# Altium project WaveRadio.PrjPCB
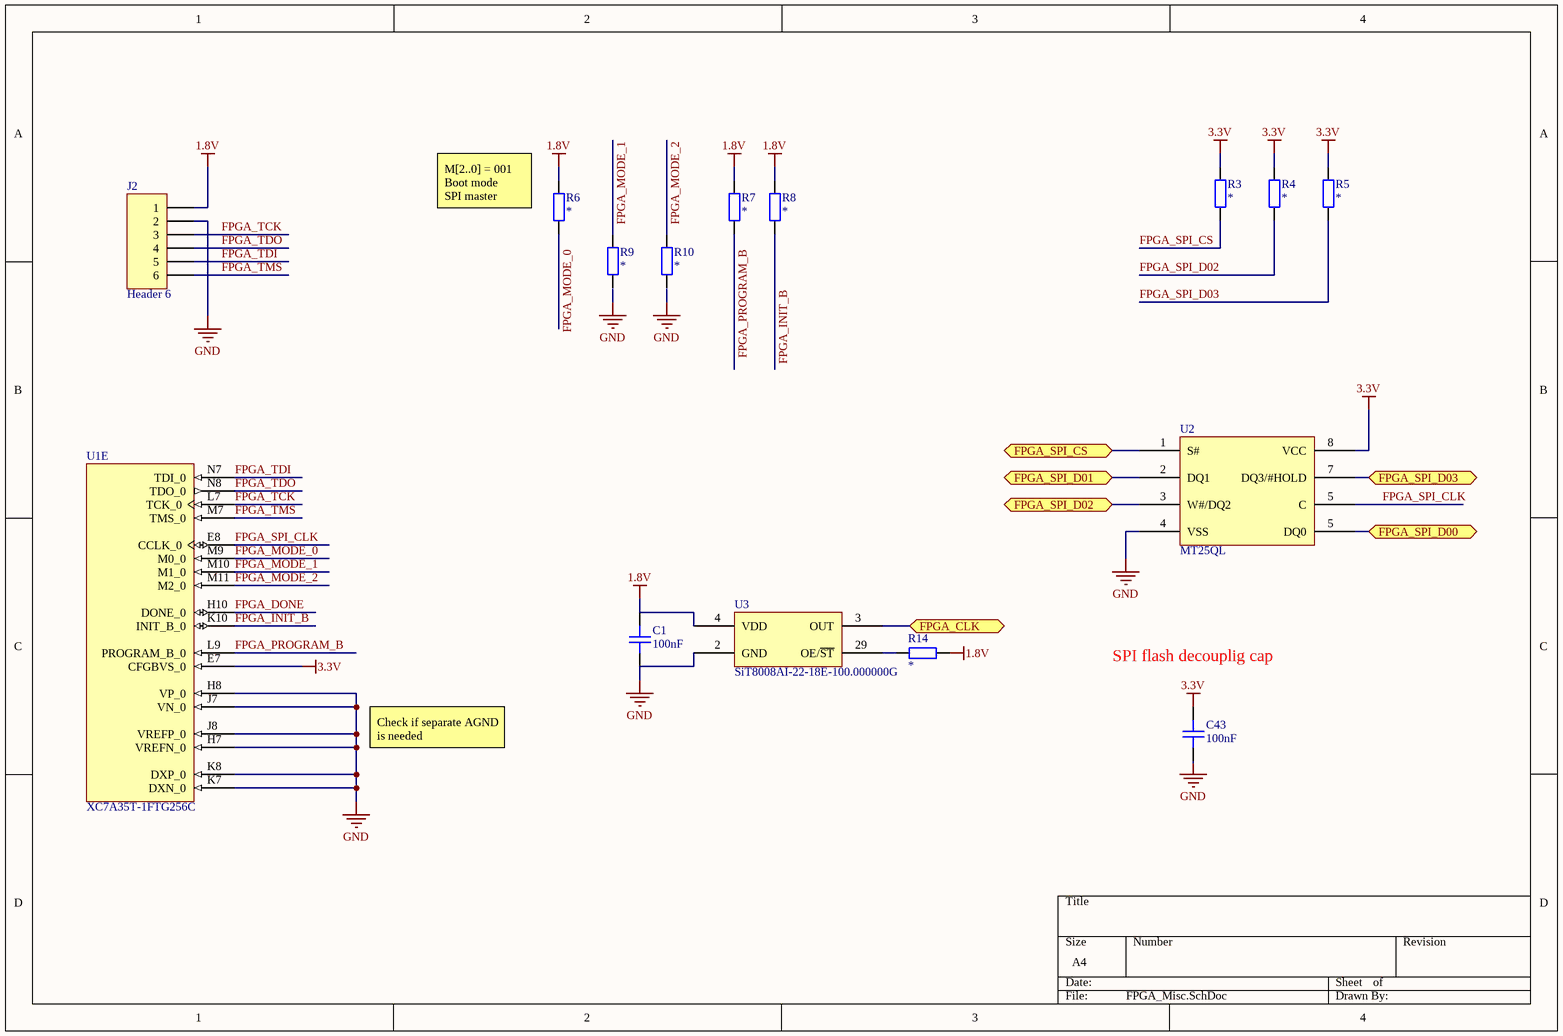
[diagram p0: FPGA_Misc.SchDoc]
4 sheets, 103 parts. Net scope: flat (ports and power ports of the same name join across sheets).
Board file: PCB1.PcbDoc
Sheets:
  FPGA_Misc.SchDoc
  USB3.0.SchDoc
  FPGA_Banks.SchDoc
  FPGA_Power.SchDoc

## Sheet FPGA_Misc.SchDoc
size A4

### Parts
C1  100nF  [CAP0402]
C43  100nF  [CAP0402]
J2  Header 6  [HDR1X6]
R3  *  [RES0402]
R4  *  [RES0402]
R5  *  [RES0402]
R6  *  [RES0402]
R7  *  [RES0402]
R8  *  [RES0402]
R9  *  [RES0402]
R10  *  [RES0402]
R14  *  [RES0402]
U1  XC7A35T-1FTG256C  [FTG256]  (part E of 8)
U2  MT25QL
U3  SiT8008AI-22-18E-100.000000G

### Ports
FPGA_CLK, FPGA_SPI_CS, FPGA_SPI_D00, FPGA_SPI_D01, FPGA_SPI_D02, FPGA_SPI_D03

### Nets
1.8V: J2.1 U3.4(VDD)
3.3V: U1.E7(CFGBVS_0) U2.8(VCC)
GND: J2.2 U1.H7(VREFN_0) U1.H8(VP_0) U1.J7(VN_0) U1.J8(VREFP_0) U1.K7(DXN_0) U1.K8(DXP_0) U2.4(VSS) U3.2(GND)
FPGA_DONE: U1.H10(DONE_0)
FPGA_INIT_B: U1.K10(INIT_B_0)
FPGA_MODE_0: U1.M9(M0_0)
FPGA_MODE_1: U1.M10(M1_0)
FPGA_MODE_2: U1.M11(M2_0)
FPGA_PROGRAM_B: U1.L9(PROGRAM_B_0)
FPGA_SPI_CLK: U1.E8(CCLK_0) U2.5(C)
FPGA_SPI_CS: U2.1(S#) ; port FPGA_SPI_CS
FPGA_SPI_D00: U2.5(DQ0) ; port FPGA_SPI_D00
FPGA_SPI_D01: U2.2(DQ1) ; port FPGA_SPI_D01
FPGA_SPI_D02: U2.3(W#/DQ2) ; port FPGA_SPI_D02
FPGA_SPI_D03: U2.7(DQ3/#HOLD) ; port FPGA_SPI_D03
FPGA_TCK: J2.3 U1.L7(TCK_0)
FPGA_TDI: J2.5 U1.N7(TDI_0)
FPGA_TDO: J2.4 U1.N8(TDO_0)
FPGA_TMS: J2.6 U1.M7(TMS_0)
NetU1_N14: U3.3(OUT) ; port FPGA_CLK

Not connected (* = marked no-connect by the designer): C1 1 2; C43 1 2; R3 1 2; R4 1 2; R5 1 2; R6 1 2; R7 1 2; R8 1 2; R9 1 2; R10 1 2; R14 1 2; U3 29(OE/~{ST})

### Notes on the sheet
- (near R6) M[2..0] = 001
  Boot mode
  SPI master
- (near C43) SPI flash decouplig cap
- Check if separate AGND is needed
- Labels drawn without touching a wire or pin: 1.8V, 3.3V

### Library data of the parts
C1 C43 = Cap_0402: Value: 100nF
J2 = Header 6: Header, 6-Pin; LatestRevisionDate: 17-Jul-2002; LatestRevisionNote: Re-released for DXP Platform.; Publisher: Altium Limited
R3-R10 R14 = Res_0402: Value: *
U1 = XC7A35T-1FTG256C: Artix-7 FPGA, 170 User I/Os, 0 GTP, 256-Ball BGA, Speed Grade 1, Commercial Grade, Pb-Free; Manufacturer: Xilinx; Total Block RAM: 1800 Kb; GTP: 0; Clock Mgmt Tiles (CMTs): 5; Logic Cells: 33280; Available User I/O: 170; Speed Grades: 1; DatasheetVersion: v1.15; PackageVersion: Rev. 1.11; PackageReference: FTG-256; PackageDescription: 256-Ball Wire-Bond Fine-Pitch Thin BGA, Body 17 x 17 mm, Pitch 1 mm; Maximum Distributed RAM: 400 Kb; Operating Temperature Range: Commercial; NexusDeviceID: XC7A35T-1FTG256C; Mounting Technology: Surface Mount; PartNumber: XC7A35T-1FTG256C; ComponentLink1Description: Manufacturer URL; ComponentLink1URL: http://www.xilinx.com/; ComponentLink2Description: Datasheet; ComponentLink2URL: http://www.xilinx.com/support/documentation/data_sheets/ds180_7Series_Overview.pdf; ComponentLink3Description: Package Specification; ComponentLink3URL: http://www.xilinx.com/support/documentation/user_guides/ug475_7Series_Pkg_Pinout.pdf; ComponentLink4Description: DC and Switching Characteristics; ComponentLink4URL: http://www.xilinx.com/support/documentation/data_sheets/ds181_Artix_7_Data_Sheet.pdf; ComponentLink5Description: Package File; ComponentLink5URL: http://www.xilinx.com/support/packagefiles/a7packages/xc7a200tsbg484pkg.txt; ComponentLink6Description: Packaging and Pinout; ComponentLink6URL: http://www.xilinx.com/support/documentation/user_guides/ug475_7Series_Pkg_Pinout.pdf

## Sheet USB3.0.SchDoc: USB
size A3
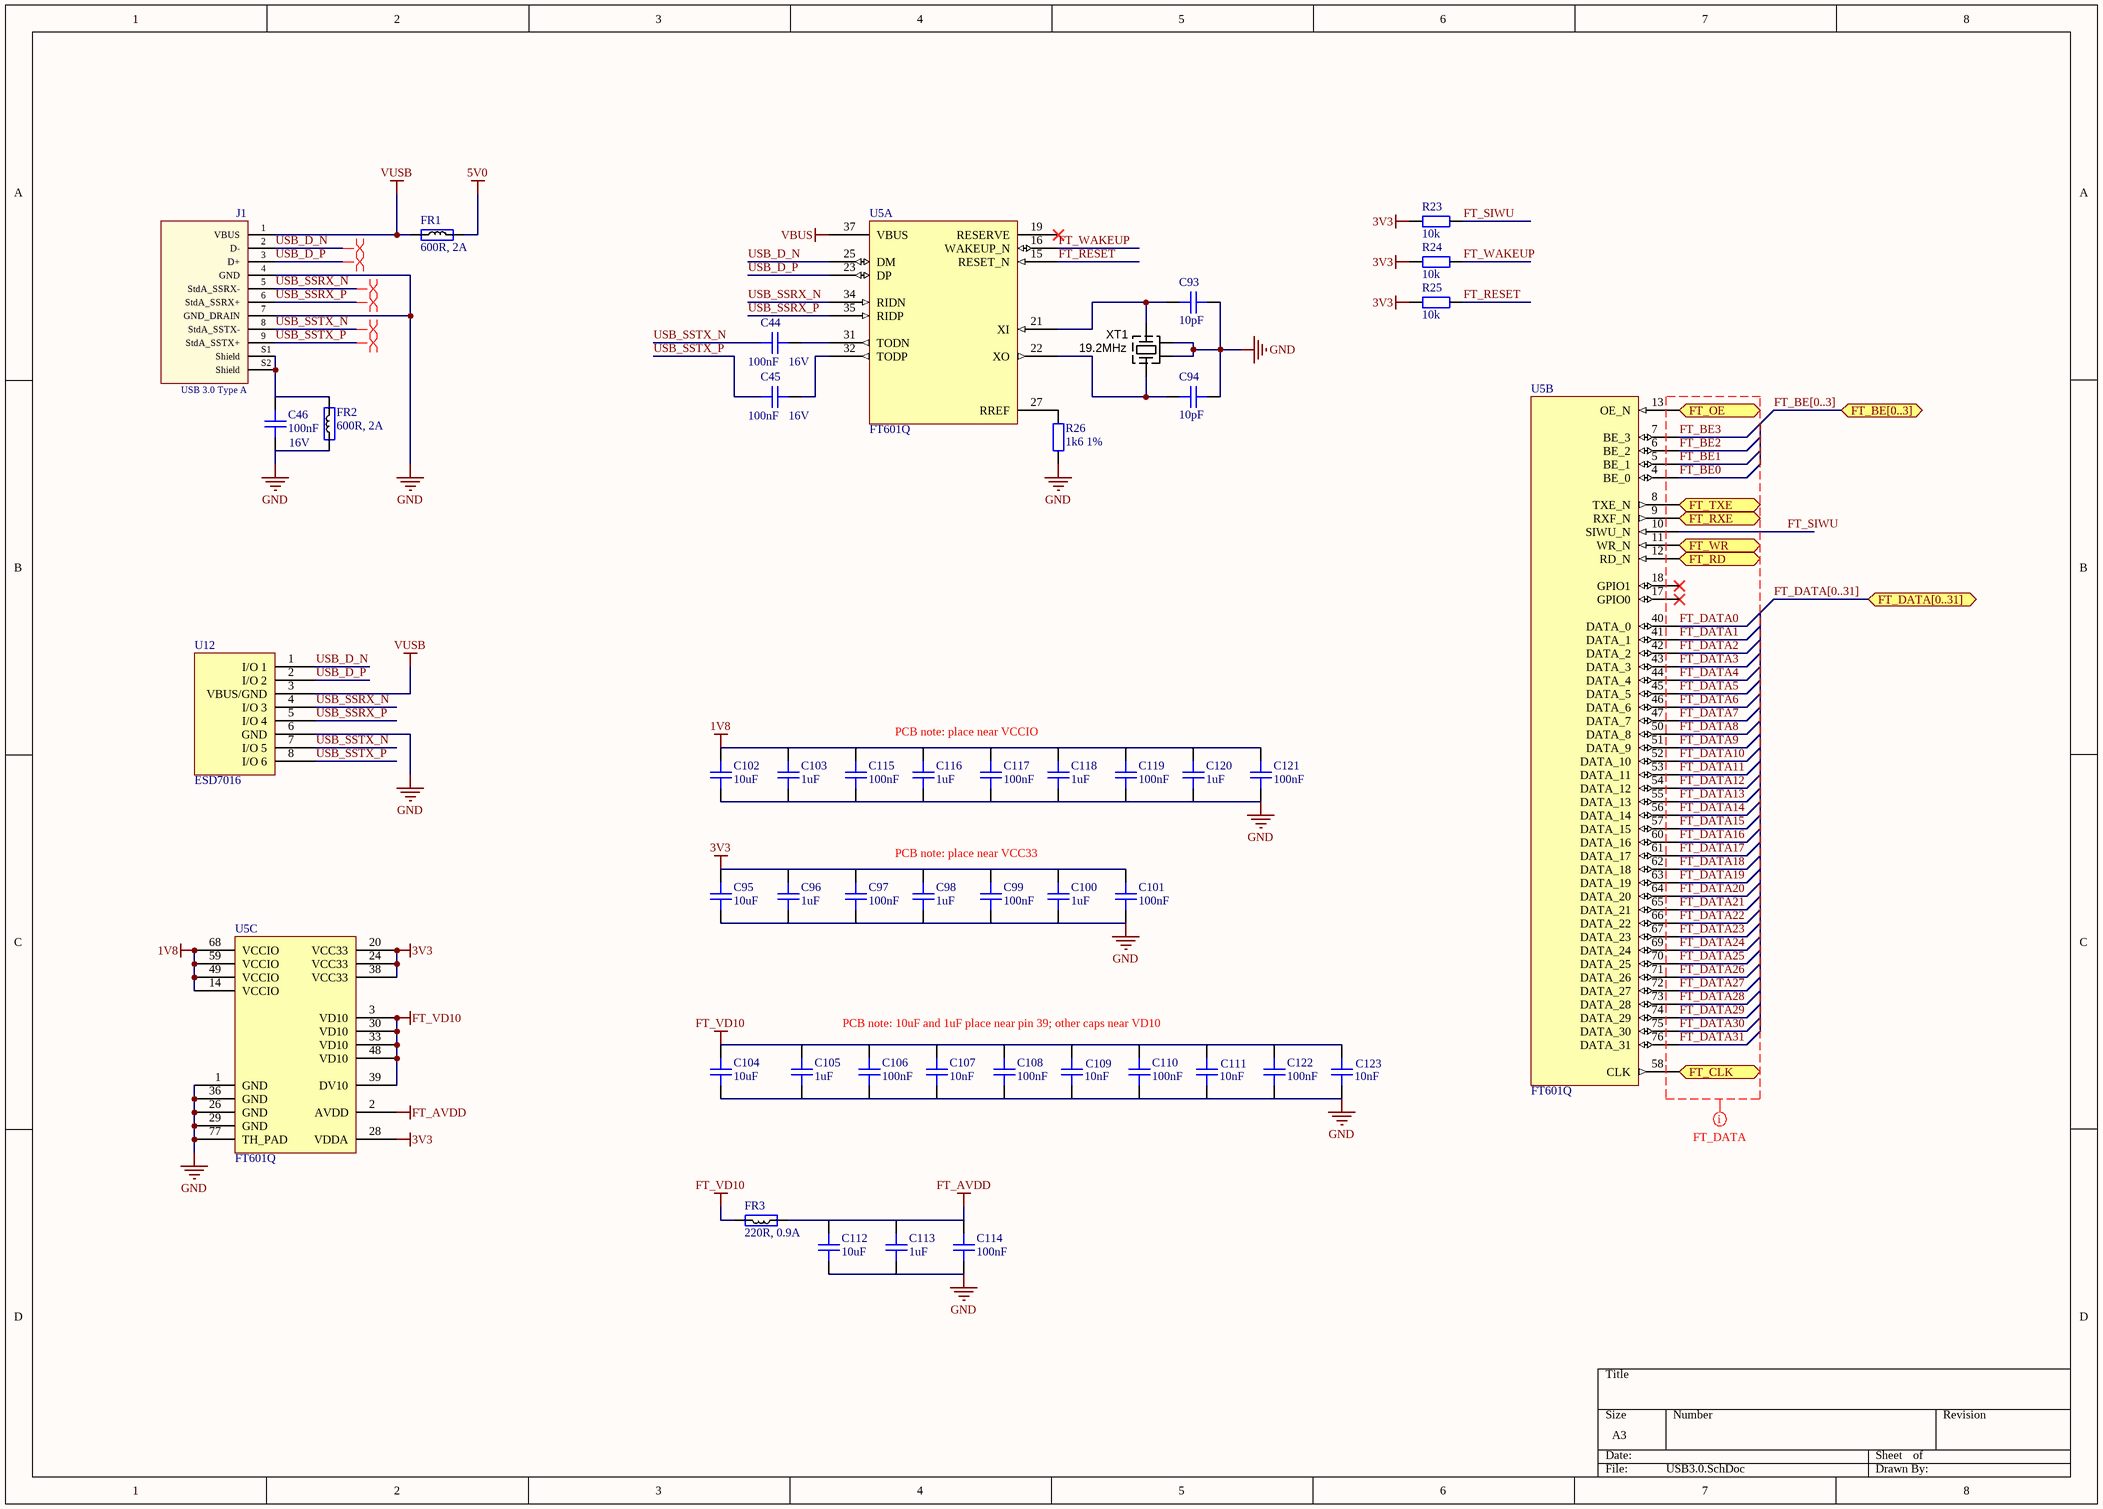
[diagram p1: USB3.0.SchDoc]

### Parts
C44  100nF  Voltage Rating: 16V  [CAP0402]
C45  100nF  Voltage Rating: 16V  [CAP0402]
C46  100nF  Voltage Rating: 16V  [CAP0402]
C93  10pF  [CAP0402]
C94  10pF  [CAP0402]
C95  10uF  [CAP0402]
C96  1uF  [CAP0402]
C97  100nF  [CAP0402]
C98  1uF  [CAP0402]
C99  100nF  [CAP0402]
C100  1uF  [CAP0402]
C101  100nF  [CAP0402]
C102  10uF  [CAP0402]
C103  1uF  [CAP0402]
C104  10uF  [CAP0402]
C105  1uF  [CAP0402]
C106  100nF  [CAP0402]
C107  10nF  [CAP0402]
C108  100nF  [CAP0402]
C109  10nF  [CAP0402]
C110  100nF  [CAP0402]
C111  10nF  [CAP0402]
C112  10uF  [CAP0402]
C113  1uF  [CAP0402]
C114  100nF  [CAP0402]
C115  100nF  [CAP0402]
C116  1uF  [CAP0402]
C117  100nF  [CAP0402]
C118  1uF  [CAP0402]
C119  100nF  [CAP0402]
C120  1uF  [CAP0402]
C121  100nF  [CAP0402]
C122  100nF  [CAP0402]
C123  10nF  [CAP0402]
FR1  600R, 2A  [RES0402]
FR2  600R, 2A  [RES0402]
FR3  220R, 0.9A  [RES0402]
J1  USB 3.0 Type A  [692122030100]
R23  10k  [RES0402]
R24  10k  [RES0402]
R25  10k  [RES0402]
R26  1k6 1%  [RES0402]
U5  FT601Q  [FT601Q]  (parts A,B,C of 3)
U12  ESD7016  [ESD7016]
XT1  19.2MHz  [CRYSTAL_4-LCC]

### Ports
FT_BE[0..3] (bidir), FT_CLK, FT_DATA[0..31] (bidir), FT_OE, FT_RD, FT_RXE, FT_TXE, FT_WR

### Nets
1V8: U5.14(VCCIO) U5.49(VCCIO) U5.59(VCCIO) U5.68(VCCIO)
3V3: U5.20(VCC33) U5.24(VCC33) U5.28(VDDA) U5.38(VCC33)
FT_AVDD: U5.2(AVDD)
FT_VD10: U5.3(VD10) U5.30(VD10) U5.33(VD10) U5.39(DV10) U5.48(VD10)
GND: J1.4(GND) J1.7(GND_DRAIN) U5.1(GND) U5.26(GND) U5.29(GND) U5.36(GND) U5.77(TH_PAD) U12.6(GND)
VBUS: U5.37(VBUS)
VUSB: J1.1(VBUS) U12.3(VBUS/GND)
FT_BE0: U5.4(BE_0)
FT_BE1: U5.5(BE_1)
FT_BE2: U5.6(BE_2)
FT_BE3: U5.7(BE_3)
FT_DATA0: U5.40(DATA_0)
FT_DATA1: U5.41(DATA_1)
FT_DATA2: U5.42(DATA_2)
FT_DATA3: U5.43(DATA_3)
FT_DATA4: U5.44(DATA_4)
FT_DATA5: U5.45(DATA_5)
FT_DATA6: U5.46(DATA_6)
FT_DATA7: U5.47(DATA_7)
FT_DATA8: U5.50(DATA_8)
FT_DATA9: U5.51(DATA_9)
FT_DATA10: U5.52(DATA_10)
FT_DATA11: U5.53(DATA_11)
FT_DATA12: U5.54(DATA_12)
FT_DATA13: U5.55(DATA_13)
FT_DATA14: U5.56(DATA_14)
FT_DATA15: U5.57(DATA_15)
FT_DATA16: U5.60(DATA_16)
FT_DATA17: U5.61(DATA_17)
FT_DATA18: U5.62(DATA_18)
FT_DATA19: U5.63(DATA_19)
FT_DATA20: U5.64(DATA_20)
FT_DATA21: U5.65(DATA_21)
FT_DATA22: U5.66(DATA_22)
FT_DATA23: U5.67(DATA_23)
FT_DATA24: U5.69(DATA_24)
FT_DATA25: U5.70(DATA_25)
FT_DATA26: U5.71(DATA_26)
FT_DATA27: U5.72(DATA_27)
FT_DATA28: U5.73(DATA_28)
FT_DATA29: U5.74(DATA_29)
FT_DATA30: U5.75(DATA_30)
FT_DATA31: U5.76(DATA_31)
FT_OE: U5.13(OE_N) ; port FT_OE
FT_RD: U5.12(RD_N) ; port FT_RD
FT_RESET: U5.15(RESET_N)
FT_RXE: U5.9(RXF_N) ; port FT_RXE
FT_SIWU: U5.10(SIWU_N)
FT_TXE: U5.8(TXE_N) ; port FT_TXE
FT_WAKEUP: U5.16(WAKEUP_N)
FT_WR: U5.11(WR_N) ; port FT_WR
USB_D_N: J1.2(D-) U5.25(DM) U12.1(I/O_1)
USB_D_P: J1.3(D+) U5.23(DP) U12.2(I/O_2)
USB_SSRX_N: J1.5(StdA_SSRX-) U5.34(RIDN) U12.4(I/O_3)
USB_SSRX_P: J1.6(StdA_SSRX+) U5.35(RIDP) U12.5(I/O_4)
USB_SSTX_N: C44.2 J1.8(StdA_SSTX-) U12.7(I/O_5)
USB_SSTX_P: C45.2 J1.9(StdA_SSTX+) U12.8(I/O_6)
NetJ1_S1: J1.S1(Shield) J1.S2(Shield)
NetU5_58: U5.58(CLK) ; port FT_CLK

Not connected (* = marked no-connect by the designer): C44 1; C45 1; C46 1 2; C93 1 2; C94 1 2; C95 1 2; C96 1 2; C97 1 2; C98 1 2; C99 1 2; C100 1 2; C101 1 2; C102 1 2; C103 1 2; C104 1 2; C105 1 2; C106 1 2; C107 1 2; C108 1 2; C109 1 2; C110 1 2; C111 1 2; C112 1 2; C113 1 2; C114 1 2; C115 1 2; C116 1 2; C117 1 2; C118 1 2; C119 1 2; C120 1 2; C121 1 2; C122 1 2; C123 1 2; FR1 1 2; FR2 1 2; FR3 1 2; R23 1 2; R24 1 2; R25 1 2; R26 1 2; U5 17(GPIO0)* 18(GPIO1)* 19(RESERVE)* 21(XI) 22(XO) 27(RREF) 31(TODN) 32(TODP); XT1 1(X) 2(GND) 3(X) 4(GND)

### Buses and harness runs
bus FT_BE[0..3] = port FT_BE[0..3]
bus FT_DATA[0..31] = port FT_DATA[0..31]

### Layout directives
net class Undefined: FT_BE0, FT_BE1, FT_BE2, FT_BE3, FT_DATA0, FT_DATA1, FT_DATA2, FT_DATA3, FT_DATA4, FT_DATA5, FT_DATA6, FT_DATA7, FT_DATA8, FT_DATA9, FT_DATA10, FT_DATA11, FT_DATA12, FT_DATA13, FT_DATA14, FT_DATA15, FT_DATA16, FT_DATA17, FT_DATA18, FT_DATA19, FT_DATA20, FT_DATA21, FT_DATA22, FT_DATA23, FT_DATA24, FT_DATA25, FT_DATA26, FT_DATA27, FT_DATA28, FT_DATA29, FT_DATA30, FT_DATA31
differential pair: USB_D_N, USB_D_P, USB_SSRX_N, USB_SSRX_P, USB_SSTX_N, USB_SSTX_P

### Notes on the sheet
- PCB note: place near VCCIO
- PCB note: place near VCC33
- PCB note: 10uF and 1uF place near pin 39; other caps near VD10
- Labels drawn without touching a wire or pin: 3V3, GND

### Library data of the parts
C44-C46 C93-C123 = Cap_0402
  C44-C46 C97 C99 C101 C106 C108 C110 C114 C115 C117 C119 C121 C122: Value: 100nF
  C93 C94: Value: 10pF
  C95 C102 C104 C112: Value: 10uF
  C96 C98 C100 C103 C105 C113 C116 C118 C120: Value: 1uF
  C107 C109 C111 C123: Value: 10nF
FR1-FR3 = Ferrite
J1 = 692122030100: USB 3.0 Type A Horizontal SMT WR-COM; Rated Current: 0.25 A; Gender: Female; ComponentLink1Description: Manufacturer; ComponentLink1URL: http://www.we-online.de; ComponentLink2Description: Datasheet; ComponentLink2URL: http://katalog.we-online.de/em/datasheet/692122030100.pdf; Part Number: 692122030100; Published Date: May 2018; Publisher: Wurth Elektronik; Orientation: Horizontal; Interface Type: USB 3.0 Type A; Operating Temperature: -20 to 85 degC; Mounting Technology: SMT; Packaging: Tape and Reel
R23-R26 = Res_0402
  R23-R25: Value: 10k
  R26: Value: 1k6 1%
U5 = FT601Q: Manufacturer: FTDI, Future Technology Devices International Ltd; Manufacturer Part Number 1: FT601Q-T; Function: Bridge, USB to FIFO; Standards: USB 3.0; Voltage - Supply: 1.65 V ~ 3.6 V; Protocol: USB; Interface: FIFO; Supplier 1: Digi-Key; Operating Temperature: -40°C ~ 85°C; Packaging: Tray; Category: Integrated Circuits (ICs); Package / Case: 76-VFQFN Exposed Pad; Supplier Device Package: 76-QFN (9x9); Current - Supply: -; RoHS: RoHS Compliant; Supplier Part Number 1: 768-1252-ND
U12 = ESD7016: Manufacturer Part Number 1: ESD7016MUTAG; Manufacturer: ON Semiconductor; Unidirectional Channels: 8; Capacitance @ Frequency: 0.15pF @ 1MHz; Power Line Protection: No; Voltage - Reverse Standoff (Typ): 5V (Max); Voltage - Breakdown (Min): 5.5V; Current - Peak Pulse (10/1000µs): 1A (8/20µs); Voltage - Clamping (Max) @ Ipp: 10V; Supplier 1: Digi-Key; Category: Circuit Protection; RoHS: RoHS Compliant; Bidirectional Channels: -; Packaging: Digi-Reel®; Type: Zener; Operating Temperature: -55°C ~ 125°C (TJ); Mounting Type: Surface Mount; Power - Peak Pulse: -; Package / Case: 8-UFSFN; Supplier Device Package: 8-UDFN (3.3x1.0); Applications: General Purpose; Supplier Part Number 1: ESD7016MUTAGOSDKR-ND
XT1 = CRYSTAL_19M2: Oscillator Crystal 27.12 MHz 10ppm; Manufacturer 1: TXC CORPORATION; Manufacturer Part Number 1: 7M-27.120MEEQ-T; Ratings: 4.9152 MHz Crystal; Load Capacitance: 10pF; Operating Mode: Fundamental; Package / Case: 2.5mm pitch; Material: Ceramic; Supplier 1: Digi-Key; Supplier Part Number 1: 887-1329-1-ND; Type: MHz Crystal; Frequency Stability: ±10ppm; Frequency Tolerance: ±10ppm; Operating Temperature: -20°C ~ 70°C; Mounting Type: Surface Mount; Size / Dimension: 0.126" L x 0.098" W (3.20mm x 2.50mm); ComponentLink1URL: http://www.txccrystal.com/images/pdf/7m-accuracy.pdf; ComponentLink1Description: http://www.txccrystal.com/images/pdf/7m-accuracy.pdf

## Sheet FPGA_Banks.SchDoc
size B
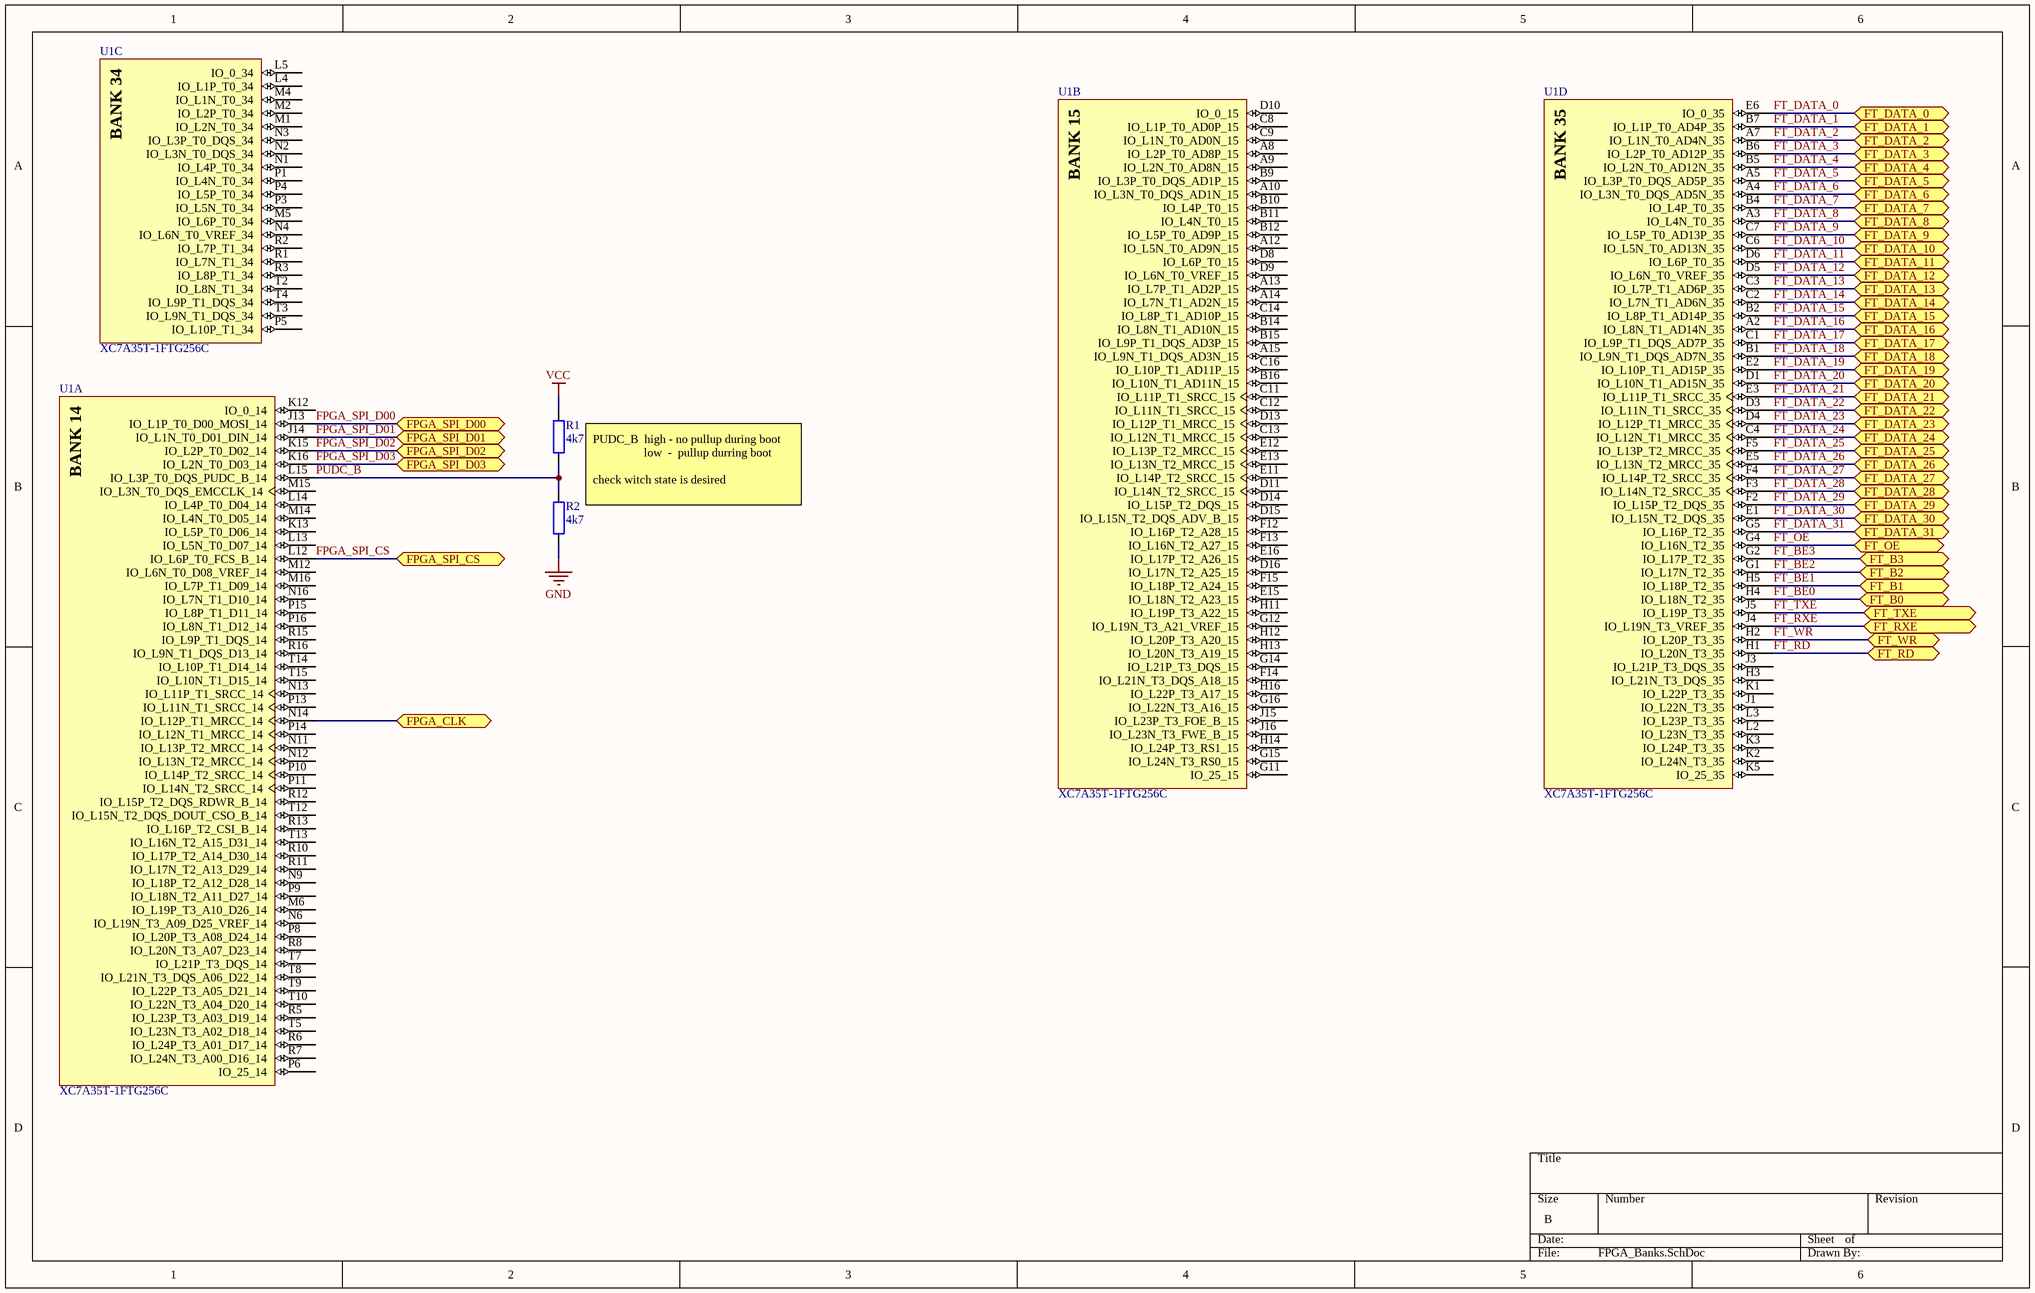
[diagram p2: FPGA_Banks.SchDoc]

### Parts
R1  4k7  [RES0402]
R2  4k7  [RES0402]
U1  XC7A35T-1FTG256C  [FTG256]  (parts A,B,C,D of 8)

### Ports
FPGA_CLK, FPGA_SPI_CS, FPGA_SPI_D00, FPGA_SPI_D01, FPGA_SPI_D02, FPGA_SPI_D03, FT_B0, FT_B1, FT_B2, FT_B3, FT_DATA_0, FT_DATA_1, FT_DATA_2, FT_DATA_3, FT_DATA_4, FT_DATA_5, FT_DATA_6, FT_DATA_7, FT_DATA_8, FT_DATA_9, FT_DATA_10, FT_DATA_11, FT_DATA_12, FT_DATA_13, FT_DATA_14, FT_DATA_15, FT_DATA_16, FT_DATA_17, FT_DATA_18, FT_DATA_19, FT_DATA_20, FT_DATA_21, FT_DATA_22, FT_DATA_23, FT_DATA_24, FT_DATA_25, FT_DATA_26, FT_DATA_27, FT_DATA_28, FT_DATA_29, FT_DATA_30, FT_DATA_31, FT_OE, FT_RD, FT_RXE, FT_TXE, FT_WR

### Nets
GND: R2.2
VCC: R1.1
FPGA_SPI_CS: U1.L12(IO_L6P_T0_FCS_B_14) ; port FPGA_SPI_CS
FPGA_SPI_D00: U1.J13(IO_L1P_T0_D00_MOSI_14) ; port FPGA_SPI_D00
FPGA_SPI_D01: U1.J14(IO_L1N_T0_D01_DIN_14) ; port FPGA_SPI_D01
FPGA_SPI_D02: U1.K15(IO_L2P_T0_D02_14) ; port FPGA_SPI_D02
FPGA_SPI_D03: U1.K16(IO_L2N_T0_D03_14) ; port FPGA_SPI_D03
FT_BE0: U1.H4(IO_L18N_T2_35) ; port FT_B0
FT_BE1: U1.H5(IO_L18P_T2_35) ; port FT_B1
FT_BE2: U1.G1(IO_L17N_T2_35) ; port FT_B2
FT_BE3: U1.G2(IO_L17P_T2_35) ; port FT_B3
FT_DATA_0: U1.E6(IO_0_35) ; port FT_DATA_0
FT_DATA_1: U1.B7(IO_L1P_T0_AD4P_35) ; port FT_DATA_1
FT_DATA_2: U1.A7(IO_L1N_T0_AD4N_35) ; port FT_DATA_2
FT_DATA_3: U1.B6(IO_L2P_T0_AD12P_35) ; port FT_DATA_3
FT_DATA_4: U1.B5(IO_L2N_T0_AD12N_35) ; port FT_DATA_4
FT_DATA_5: U1.A5(IO_L3P_T0_DQS_AD5P_35) ; port FT_DATA_5
FT_DATA_6: U1.A4(IO_L3N_T0_DQS_AD5N_35) ; port FT_DATA_6
FT_DATA_7: U1.B4(IO_L4P_T0_35) ; port FT_DATA_7
FT_DATA_8: U1.A3(IO_L4N_T0_35) ; port FT_DATA_8
FT_DATA_9: U1.C7(IO_L5P_T0_AD13P_35) ; port FT_DATA_9
FT_DATA_10: U1.C6(IO_L5N_T0_AD13N_35) ; port FT_DATA_10
FT_DATA_11: U1.D6(IO_L6P_T0_35) ; port FT_DATA_11
FT_DATA_12: U1.D5(IO_L6N_T0_VREF_35) ; port FT_DATA_12
FT_DATA_13: U1.C3(IO_L7P_T1_AD6P_35) ; port FT_DATA_13
FT_DATA_14: U1.C2(IO_L7N_T1_AD6N_35) ; port FT_DATA_14
FT_DATA_15: U1.B2(IO_L8P_T1_AD14P_35) ; port FT_DATA_15
FT_DATA_16: U1.A2(IO_L8N_T1_AD14N_35) ; port FT_DATA_16
FT_DATA_17: U1.C1(IO_L9P_T1_DQS_AD7P_35) ; port FT_DATA_17
FT_DATA_18: U1.B1(IO_L9N_T1_DQS_AD7N_35) ; port FT_DATA_18
FT_DATA_19: U1.E2(IO_L10P_T1_AD15P_35) ; port FT_DATA_19
FT_DATA_20: U1.D1(IO_L10N_T1_AD15N_35) ; port FT_DATA_20
FT_DATA_21: U1.E3(IO_L11P_T1_SRCC_35) ; port FT_DATA_21
FT_DATA_22: U1.D3(IO_L11N_T1_SRCC_35) ; port FT_DATA_22
FT_DATA_23: U1.D4(IO_L12P_T1_MRCC_35) ; port FT_DATA_23
FT_DATA_24: U1.C4(IO_L12N_T1_MRCC_35) ; port FT_DATA_24
FT_DATA_25: U1.F5(IO_L13P_T2_MRCC_35) ; port FT_DATA_25
FT_DATA_26: U1.E5(IO_L13N_T2_MRCC_35) ; port FT_DATA_26
FT_DATA_27: U1.F4(IO_L14P_T2_SRCC_35) ; port FT_DATA_27
FT_DATA_28: U1.F3(IO_L14N_T2_SRCC_35) ; port FT_DATA_28
FT_DATA_29: U1.F2(IO_L15P_T2_DQS_35) ; port FT_DATA_29
FT_DATA_30: U1.E1(IO_L15N_T2_DQS_35) ; port FT_DATA_30
FT_DATA_31: U1.G5(IO_L16P_T2_35) ; port FT_DATA_31
FT_OE: U1.G4(IO_L16N_T2_35) ; port FT_OE
FT_RD: U1.H1(IO_L20N_T3_35) ; port FT_RD
FT_RXE: U1.J4(IO_L19N_T3_VREF_35) ; port FT_RXE
FT_TXE: U1.J5(IO_L19P_T3_35) ; port FT_TXE
FT_WR: U1.H2(IO_L20P_T3_35) ; port FT_WR
PUDC_B: R1.2 R2.1 U1.L15(IO_L3P_T0_DQS_PUDC_B_14)
NetU1_N14: U1.N14(IO_L12P_T1_MRCC_14) ; port FPGA_CLK

Not connected (* = marked no-connect by the designer): U1 A8(IO_L2P_T0_AD8P_15) A9(IO_L2N_T0_AD8N_15) A10(IO_L3N_T0_DQS_AD1N_15) A12(IO_L5N_T0_AD9N_15) A13(IO_L7P_T1_AD2P_15) A14(IO_L7N_T1_AD2N_15) A15(IO_L9N_T1_DQS_AD3N_15) B9(IO_L3P_T0_DQS_AD1P_15) B10(IO_L4P_T0_15) B11(IO_L4N_T0_15) B12(IO_L5P_T0_AD9P_15) B14(IO_L8N_T1_AD10N_15) B15(IO_L9P_T1_DQS_AD3P_15) B16(IO_L10N_T1_AD11N_15) C8(IO_L1P_T0_AD0P_15) C9(IO_L1N_T0_AD0N_15) C11(IO_L11P_T1_SRCC_15) C12(IO_L11N_T1_SRCC_15) C13(IO_L12N_T1_MRCC_15) C14(IO_L8P_T1_AD10P_15) C16(IO_L10P_T1_AD11P_15) D8(IO_L6P_T0_15) D9(IO_L6N_T0_VREF_15) D10(IO_0_15) D11(IO_L14N_T2_SRCC_15) D13(IO_L12P_T1_MRCC_15) D14(IO_L15P_T2_DQS_15) D15(IO_L15N_T2_DQS_ADV_B_15) D16(IO_L17N_T2_A25_15) E11(IO_L14P_T2_SRCC_15) E12(IO_L13P_T2_MRCC_15) E13(IO_L13N_T2_MRCC_15) E15(IO_L18N_T2_A23_15) E16(IO_L17P_T2_A26_15) F12(IO_L16P_T2_A28_15) F13(IO_L16N_T2_A27_15) F14(IO_L21N_T3_DQS_A18_15) F15(IO_L18P_T2_A24_15) G11(IO_25_15) G12(IO_L19N_T3_A21_VREF_15) G14(IO_L21P_T3_DQS_15) G15(IO_L24N_T3_RS0_15) G16(IO_L22N_T3_A16_15) H3(IO_L21N_T3_DQS_35) H11(IO_L19P_T3_A22_15) H12(IO_L20P_T3_A20_15) H13(IO_L20N_T3_A19_15) H14(IO_L24P_T3_RS1_15) H16(IO_L22P_T3_A17_15) J1(IO_L22N_T3_35) J3(IO_L21P_T3_DQS_35) J15(IO_L23P_T3_FOE_B_15) J16(IO_L23N_T3_FWE_B_15) K1(IO_L22P_T3_35) K2(IO_L24N_T3_35) K3(IO_L24P_T3_35) K5(IO_25_35) K12(IO_0_14) K13(IO_L5P_T0_D06_14) L2(IO_L23N_T3_35) L3(IO_L23P_T3_35) L4(IO_L1P_T0_34) L5(IO_0_34) L13(IO_L5N_T0_D07_14) L14(IO_L4P_T0_D04_14) M1(IO_L2N_T0_34) M2(IO_L2P_T0_34) M4(IO_L1N_T0_34) M5(IO_L6P_T0_34) M6(IO_L19P_T3_A10_D26_14) M12(IO_L6N_T0_D08_VREF_14) M14(IO_L4N_T0_D05_14) M15(IO_L3N_T0_DQS_EMCCLK_14) M16(IO_L7P_T1_D09_14) N1(IO_L4P_T0_34) N2(IO_L3N_T0_DQS_34) N3(IO_L3P_T0_DQS_34) N4(IO_L6N_T0_VREF_34) N6(IO_L19N_T3_A09_D25_VREF_14) N9(IO_L18P_T2_A12_D28_14) N11(IO_L13P_T2_MRCC_14) N12(IO_L13N_T2_MRCC_14) N13(IO_L11P_T1_SRCC_14) N16(IO_L7N_T1_D10_14) P1(IO_L4N_T0_34) P3(IO_L5N_T0_34) P4(IO_L5P_T0_34) P5(IO_L10P_T1_34) P6(IO_25_14) P8(IO_L20P_T3_A08_D24_14) P9(IO_L18N_T2_A11_D27_14) P10(IO_L14P_T2_SRCC_14) P11(IO_L14N_T2_SRCC_14) P13(IO_L11N_T1_SRCC_14) P14(IO_L12N_T1_MRCC_14) P15(IO_L8P_T1_D11_14) P16(IO_L8N_T1_D12_14) R1(IO_L7N_T1_34) R2(IO_L7P_T1_34) R3(IO_L8P_T1_34) R5(IO_L23P_T3_A03_D19_14) R6(IO_L24P_T3_A01_D17_14) R7(IO_L24N_T3_A00_D16_14) R8(IO_L20N_T3_A07_D23_14) R10(IO_L17P_T2_A14_D30_14) R11(IO_L17N_T2_A13_D29_14) R12(IO_L15P_T2_DQS_RDWR_B_14) R13(IO_L16P_T2_CSI_B_14) R15(IO_L9P_T1_DQS_14) R16(IO_L9N_T1_DQS_D13_14) T2(IO_L8N_T1_34) T3(IO_L9N_T1_DQS_34) T4(IO_L9P_T1_DQS_34) T5(IO_L23N_T3_A02_D18_14) T7(IO_L21P_T3_DQS_14) T8(IO_L21N_T3_DQS_A06_D22_14) T9(IO_L22P_T3_A05_D21_14) T10(IO_L22N_T3_A04_D20_14) T12(IO_L15N_T2_DQS_DOUT_CSO_B_14) T13(IO_L16N_T2_A15_D31_14) T14(IO_L10P_T1_D14_14) T15(IO_L10N_T1_D15_14)

### Notes on the sheet
- PUDC_B  high - no pullup during boot
  low  -  pullup durring boot
  check witch state is desired
- (in symbol XC7A35T-1FTG256C, part A) BANK 14
- (in symbol XC7A35T-1FTG256C, part B) BANK 15
- (in symbol XC7A35T-1FTG256C, part C) BANK 34
- (in symbol XC7A35T-1FTG256C, part D) BANK 35

### Library data of the parts
R1 R2 = Res_0402: Value: 4k7
U1 = XC7A35T-1FTG256C: as U1 on sheet FPGA_Misc; DatasheetVersion: v1.15; PackageVersion: Rev. 1.11; PackageReference: FTG-256; PackageDescription: 256-Ball Wire-Bond Fine-Pitch Thin BGA, Body 17 x 17 mm, Pitch 1 mm; Maximum Distributed RAM: 400 Kb; Operating Temperature Range: Commercial; NexusDeviceID: XC7A35T-1FTG256C; Mounting Technology: Surface Mount; PartNumber: XC7A35T-1FTG256C; ComponentLink1Description: Manufacturer URL; ComponentLink1URL: http://www.xilinx.com/; ComponentLink2Description: Datasheet; ComponentLink2URL: http://www.xilinx.com/support/documentation/data_sheets/ds180_7Series_Overview.pdf; ComponentLink3Description: Package Specification; ComponentLink3URL: http://www.xilinx.com/support/documentation/user_guides/ug475_7Series_Pkg_Pinout.pdf; ComponentLink4Description: DC and Switching Characteristics; ComponentLink4URL: http://www.xilinx.com/support/documentation/data_sheets/ds181_Artix_7_Data_Sheet.pdf; ComponentLink5Description: Package File; ComponentLink5URL: http://www.xilinx.com/support/packagefiles/a7packages/xc7a200tsbg484pkg.txt; ComponentLink6Description: Packaging and Pinout; ComponentLink6URL: http://www.xilinx.com/support/documentation/user_guides/ug475_7Series_Pkg_Pinout.pdf

## Sheet FPGA_Power.SchDoc
size A4
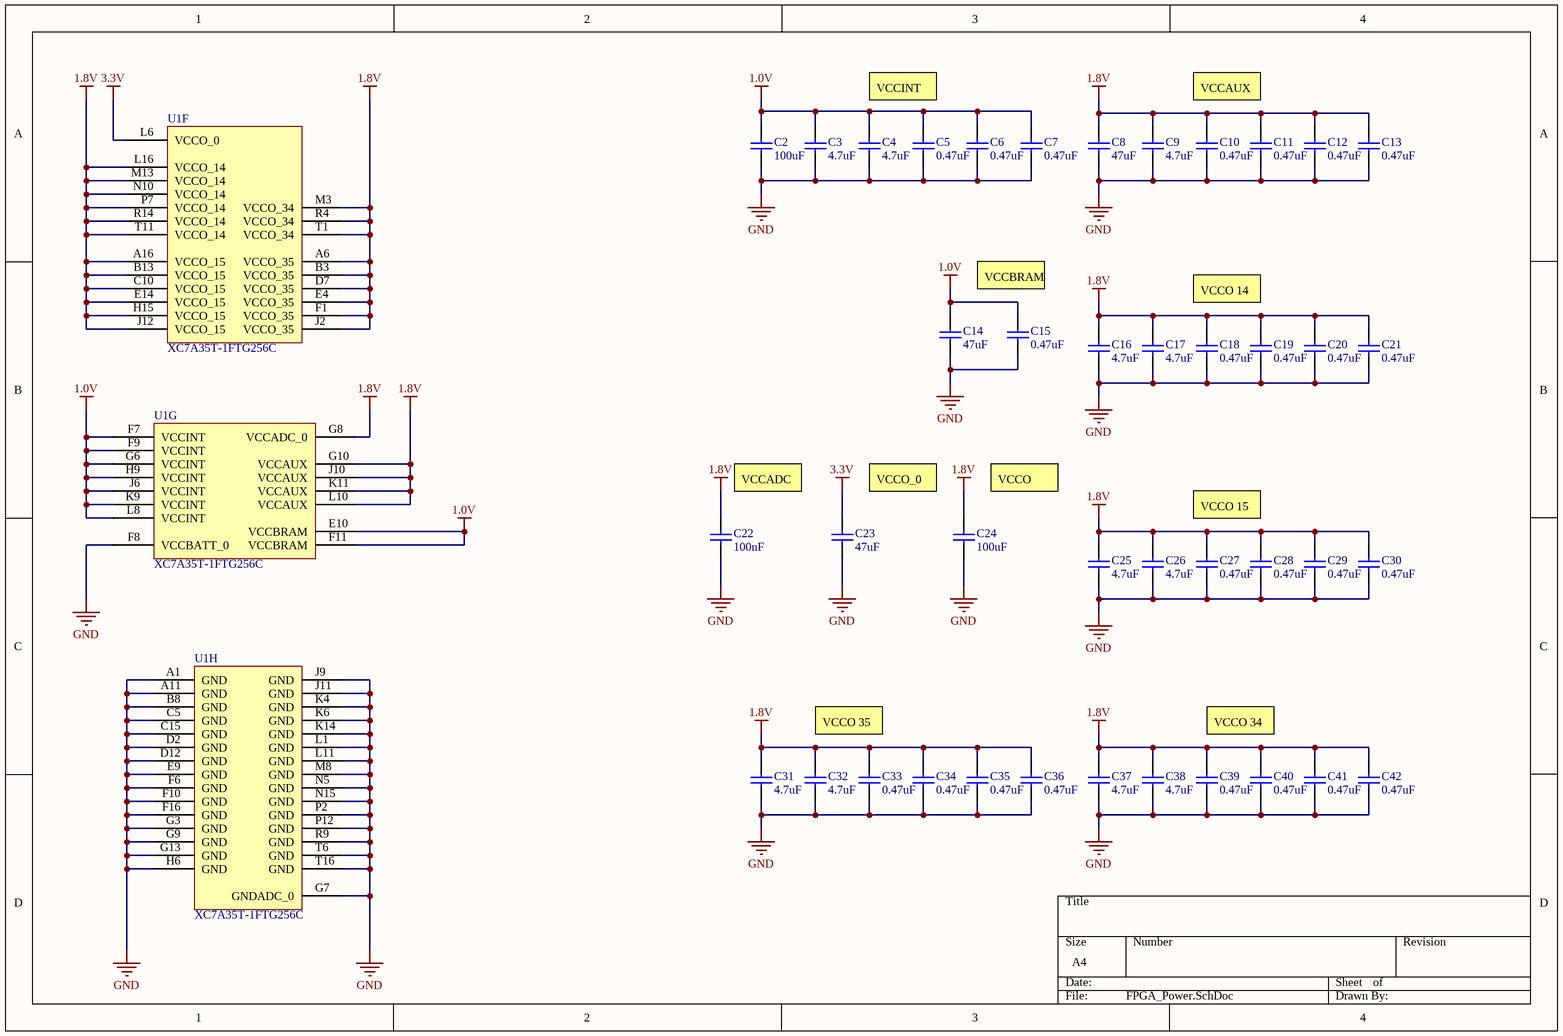
[diagram p3: FPGA_Power.SchDoc]

### Parts
C2  100uF  [CAP1206]
C3  4.7uF  [CAP1206]
C4  4.7uF  [CAP1206]
C5  0.47uF  [CAP1206]
C6  0.47uF  [CAP1206]
C7  0.47uF  [CAP1206]
C8  47uF  [CAP1206]
C9  4.7uF  [CAP1206]
C10  0.47uF  [CAP1206]
C11  0.47uF  [CAP1206]
C12  0.47uF  [CAP1206]
C13  0.47uF  [CAP1206]
C14  47uF  [CAP1206]
C15  0.47uF  [CAP1206]
C16  4.7uF  [CAP1206]
C17  4.7uF  [CAP1206]
C18  0.47uF  [CAP1206]
C19  0.47uF  [CAP1206]
C20  0.47uF  [CAP1206]
C21  0.47uF  [CAP1206]
C22  100nF  [CAP1206]
C23  47uF  [CAP1206]
C24  100uF  [CAP1206]
C25  4.7uF  [CAP1206]
C26  4.7uF  [CAP1206]
C27  0.47uF  [CAP1206]
C28  0.47uF  [CAP1206]
C29  0.47uF  [CAP1206]
C30  0.47uF  [CAP1206]
C31  4.7uF  [CAP1206]
C32  4.7uF  [CAP1206]
C33  0.47uF  [CAP1206]
C34  0.47uF  [CAP1206]
C35  0.47uF  [CAP1206]
C36  0.47uF  [CAP1206]
C37  4.7uF  [CAP1206]
C38  4.7uF  [CAP1206]
C39  0.47uF  [CAP1206]
C40  0.47uF  [CAP1206]
C41  0.47uF  [CAP1206]
C42  0.47uF  [CAP1206]
U1  XC7A35T-1FTG256C  [FTG256]  (parts F,G,H of 8)

### Nets
1.0V: C2.1 C3.1 C4.1 C5.1 C6.1 C7.1 C14.1 C15.1 U1.E10(VCCBRAM) U1.F7(VCCINT) U1.F9(VCCINT) U1.F11(VCCBRAM) U1.G6(VCCINT) U1.H9(VCCINT) U1.J6(VCCINT) U1.K9(VCCINT) U1.L8(VCCINT)
1.8V: C8.1 C9.1 C10.1 C11.1 C12.1 C13.1 C16.1 C17.1 C18.1 C19.1 C20.1 C21.1 C22.1 C24.1 C25.1 C26.1 C27.1 C28.1 C29.1 C30.1 C31.1 C32.1 C33.1 C34.1 C35.1 C36.1 C37.1 C38.1 C39.1 C40.1 C41.1 C42.1 U1.A6(VCCO_35) U1.A16(VCCO_15) U1.B3(VCCO_35) U1.B13(VCCO_15) U1.C10(VCCO_15) U1.D7(VCCO_35) U1.E4(VCCO_35) U1.E14(VCCO_15) U1.F1(VCCO_35) U1.G8(VCCADC_0) U1.G10(VCCAUX) U1.H15(VCCO_15) U1.J2(VCCO_35) U1.J10(VCCAUX) U1.J12(VCCO_15) U1.K11(VCCAUX) U1.L10(VCCAUX) U1.L16(VCCO_14) U1.M3(VCCO_34) U1.M13(VCCO_14) U1.N10(VCCO_14) U1.P7(VCCO_14) U1.R4(VCCO_34) U1.R14(VCCO_14) U1.T1(VCCO_34) U1.T11(VCCO_14)
3.3V: C23.1 U1.L6(VCCO_0)
GND: C2.2 C3.2 C4.2 C5.2 C6.2 C7.2 C8.2 C9.2 C10.2 C11.2 C12.2 C13.2 C14.2 C15.2 C16.2 C17.2 C18.2 C19.2 C20.2 C21.2 C22.2 C23.2 C24.2 C25.2 C26.2 C27.2 C28.2 C29.2 C30.2 C31.2 C32.2 C33.2 C34.2 C35.2 C36.2 C37.2 C38.2 C39.2 C40.2 C41.2 C42.2 U1.A1(GND) U1.A11(GND) U1.B8(GND) U1.C5(GND) U1.C15(GND) U1.D2(GND) U1.D12(GND) U1.E9(GND) U1.F6(GND) U1.F8(VCCBATT_0) U1.F10(GND) U1.F16(GND) U1.G3(GND) U1.G7(GNDADC_0) U1.G9(GND) U1.G13(GND) U1.H6(GND) U1.J9(GND) U1.J11(GND) U1.K4(GND) U1.K6(GND) U1.K14(GND) U1.L1(GND) U1.L11(GND) U1.M8(GND) U1.N5(GND) U1.N15(GND) U1.P2(GND) U1.P12(GND) U1.R9(GND) U1.T6(GND) U1.T16(GND)

### Notes on the sheet
- VCCINT
- VCCAUX
- VCCBRAM
- VCCO 14
- VCCADC
- VCCO_0
- (near C24) VCCO
- VCCO 15
- VCCO 35
- VCCO 34

### Library data of the parts
C2-C42 = Cap_1206: part number: GRM32ER60J107ME20L
  C2 C24: Value: 100uF
  C3 C4 C9 C16 C17 C25 C26 C31 C32 C37 C38: Value: 4.7uF
  C5-C7 C10-C13 C15 C18-C21 C27-C30 C33-C36 C39-C42: Value: 0.47uF
  C8 C14 C23: Value: 47uF
  C22: Value: 100nF
U1 = XC7A35T-1FTG256C: as U1 on sheet FPGA_Misc; DatasheetVersion: v1.15; PackageVersion: Rev. 1.11; PackageReference: FTG-256; PackageDescription: 256-Ball Wire-Bond Fine-Pitch Thin BGA, Body 17 x 17 mm, Pitch 1 mm; Maximum Distributed RAM: 400 Kb; Operating Temperature Range: Commercial; NexusDeviceID: XC7A35T-1FTG256C; Mounting Technology: Surface Mount; PartNumber: XC7A35T-1FTG256C; ComponentLink1Description: Manufacturer URL; ComponentLink1URL: http://www.xilinx.com/; ComponentLink2Description: Datasheet; ComponentLink2URL: http://www.xilinx.com/support/documentation/data_sheets/ds180_7Series_Overview.pdf; ComponentLink3Description: Package Specification; ComponentLink3URL: http://www.xilinx.com/support/documentation/user_guides/ug475_7Series_Pkg_Pinout.pdf; ComponentLink4Description: DC and Switching Characteristics; ComponentLink4URL: http://www.xilinx.com/support/documentation/data_sheets/ds181_Artix_7_Data_Sheet.pdf; ComponentLink5Description: Package File; ComponentLink5URL: http://www.xilinx.com/support/packagefiles/a7packages/xc7a200tsbg484pkg.txt; ComponentLink6Description: Packaging and Pinout; ComponentLink6URL: http://www.xilinx.com/support/documentation/user_guides/ug475_7Series_Pkg_Pinout.pdf

## Nets that join several sheets
1.8V: FPGA_Misc (J2.1 U3.4), FPGA_Power (58 pins)
3.3V: FPGA_Misc (U1.E7 U2.8), FPGA_Power (C23.1 U1.L6)
GND: FPGA_Misc (9 pins), USB3.0 (8 pins), FPGA_Banks (R2.2), FPGA_Power (73 pins)
FPGA_SPI_CS: FPGA_Misc (U2.1), FPGA_Banks (U1.L12)
FPGA_SPI_D00: FPGA_Misc (U2.5), FPGA_Banks (U1.J13)
FPGA_SPI_D01: FPGA_Misc (U2.2), FPGA_Banks (U1.J14)
FPGA_SPI_D02: FPGA_Misc (U2.3), FPGA_Banks (U1.K15)
FPGA_SPI_D03: FPGA_Misc (U2.7), FPGA_Banks (U1.K16)
FT_OE: USB3.0 (U5.13), FPGA_Banks (U1.G4)
FT_RD: USB3.0 (U5.12), FPGA_Banks (U1.H1)
FT_RXE: USB3.0 (U5.9), FPGA_Banks (U1.J4)
FT_TXE: USB3.0 (U5.8), FPGA_Banks (U1.J5)
FT_WR: USB3.0 (U5.11), FPGA_Banks (U1.H2)
NetU1_N14: FPGA_Misc (U3.3), FPGA_Banks (U1.N14)